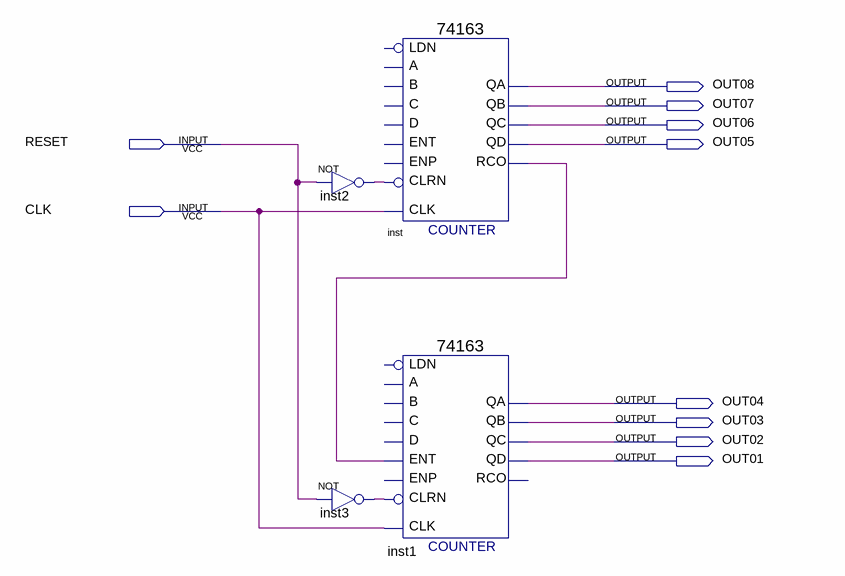
[diagram p0: schematic sheet]
// Quartus schematic COUNTER-PLUS.bdf as structural Verilog: 4 symbols, 10 pins
module \COUNTER-PLUS  (
  input  RESET,
  input  CLK,
  output OUT08,
  output OUT07,
  output OUT06,
  output OUT05,
  output OUT04,
  output OUT03,
  output OUT02,
  output OUT01
);

  wire inst2_out, inst3_out, inst_rco;

  not inst2 (inst2_out, RESET);
  not inst3 (inst3_out, RESET);
  \74163  inst (
    .CLRN(inst2_out), .CLK(CLK), .QA(OUT08), .QB(OUT07), .QC(OUT06), .QD(OUT05), .RCO(inst_rco));  // open: C, B, A, ENT, D, ENP, LDN
  \74163  inst1 (
    .ENT(inst_rco), .CLRN(inst3_out), .CLK(CLK), .QA(OUT04), .QB(OUT03), .QC(OUT02), .QD(OUT01));  // open: C, B, A, D, ENP, LDN, RCO
endmodule
